# Altium schematic sheet WL-CONTROL.SchDoc
size 420 x 297 mm; Address1: Address1; Address2: Address2; Address3: Address3; Address4: Address4; DocumentNumber: Wolf-Lite; SheetNumber: 9; Scale: 1:1; DocumentType: Схема электрическая принципиальная; FirstReferrence: UA3REO/R7KBI
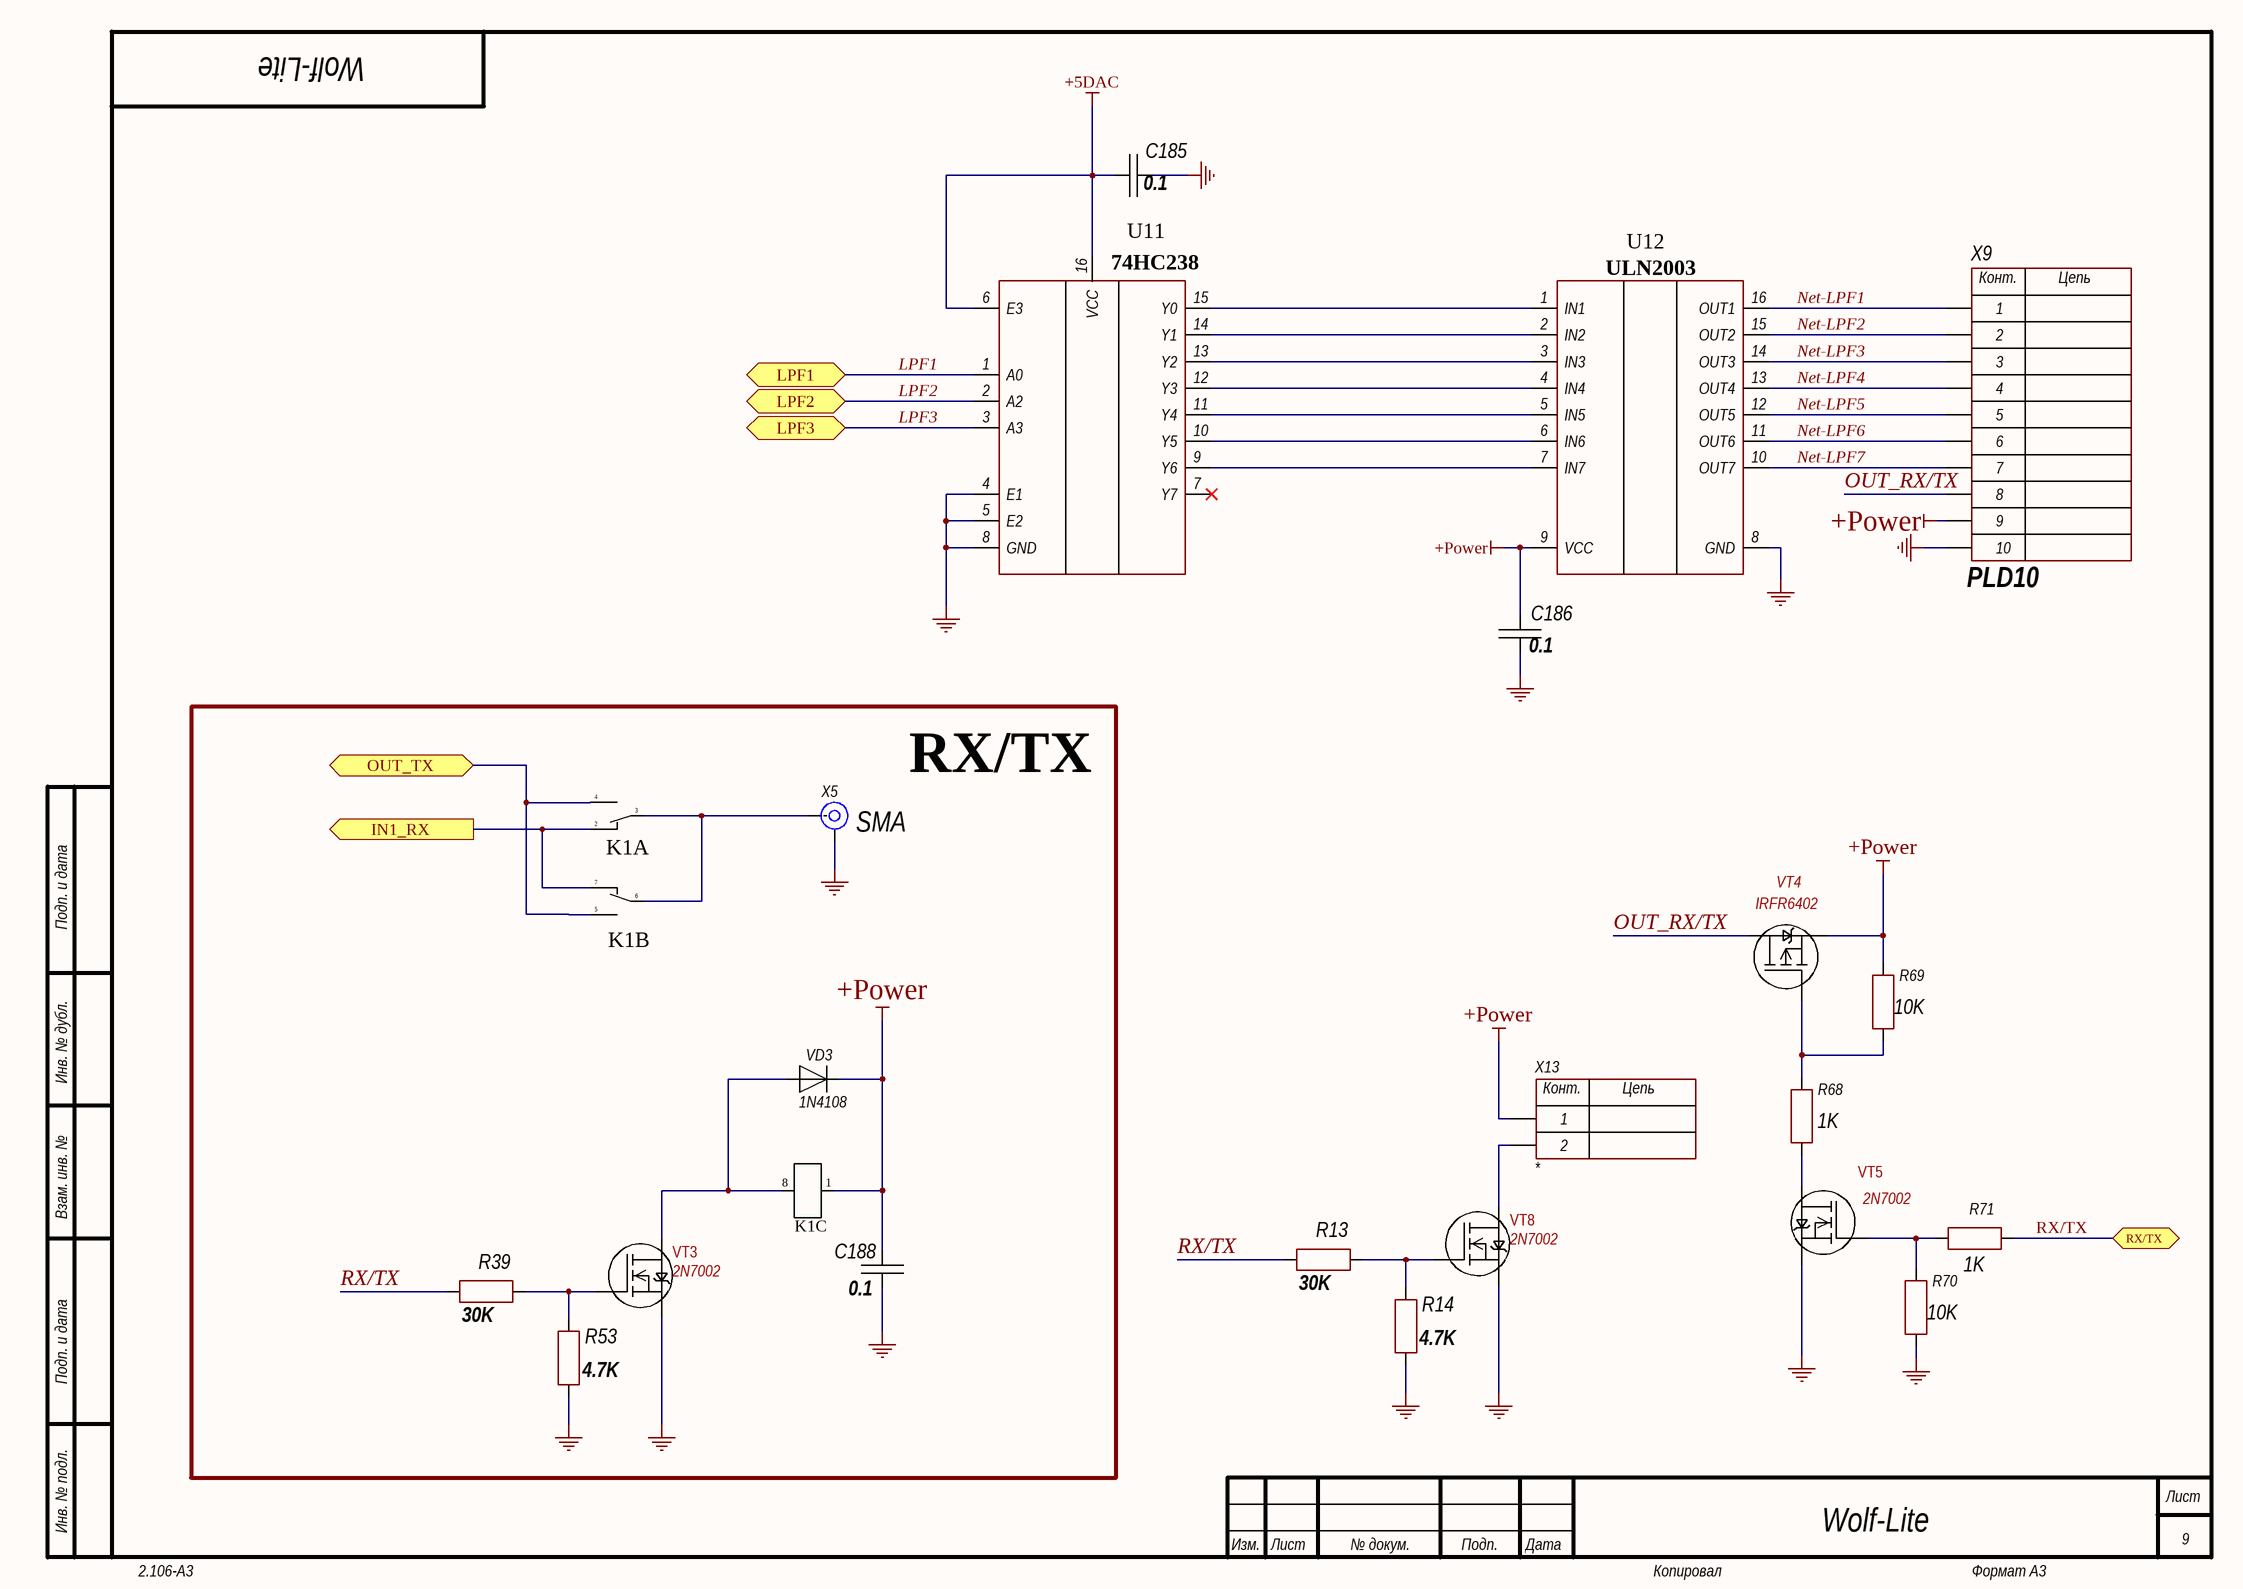
[diagram p0: WL-CONTROL.SchDoc]

## Parts
C185  0.1  [CH0805C]
C186  0.1  [CH0805C]
C188  0.1  [CH0805C]
K1  IM06  [IMG06]  (value not drawn)  (parts A,B,C of 3)
R13  30K  [CH0805R]
R14  4.7K  [CH0805R]
R39  30K  [CH0805R]
R53  4.7K  [CH0805R]
R68  1K  [CH0805R]
R69  10K  [CH0805R]
R70  10K  [CH0805R]
R71  1K  [CH0805R]
U11  74HC238  [16-SOIC]
U12  ULN2003  [16-SOIC]
VD3  1N4108  [1N4148]
VT3  2N7002  [SOT23_132]
VT4  IRFR6402  [SOT23_132]
VT5  2N7002  [SOT23_132]
VT8  2N7002  [SOT23_132]
X5  SMA  [CON: SMA]
X9  PLD10  [CON: PLD-10]
X13  *  [CON: PLS-2]

## Blocks framed on the sheet
RX/TX: C188 K1 R39 R53 VD3 VT3 X5

## Ports
IN1_RX (out), LPF1 (bidir), LPF2 (bidir), LPF3 (bidir), OUT_TX (bidir), RX/TX (bidir)

## Nets
+5DAC: C185.1 U11.6(E3) U11.16(VCC)
+Power: C186.2 C188.1 K1.1 R69.2 U12.9(VCC) VD3.2 VT4.2(I) X9.9 X13.1
GND: C185.2 C186.1 C188.2 R14.1 R53.1 R70.1 U11.4(E1) U11.5(E2) U11.8(GND) U12.8(GND) VT3.2(I) VT5.2(I) VT8.2(I) X5.2(IN) X9.10
IN1_RX: K1.2 K1.7 ; port IN1_RX
LPF1: U11.1(A0) ; port LPF1
LPF2: U11.2(A2) ; port LPF2
LPF3: U11.3(A3) ; port LPF3
Net-LPF1: U12.16(OUT1) X9.1
Net-LPF2: U12.15(OUT2) X9.2
Net-LPF3: U12.14(OUT3) X9.3
Net-LPF4: U12.13(OUT4) X9.4
Net-LPF5: U12.12(OUT5) X9.5
Net-LPF6: U12.11(OUT6) X9.6
Net-LPF7: U12.10(OUT7) X9.7
OUT_RX/TX: VT4.3(Сток(Drain)) X9.8
OUT_TX: K1.4 K1.5 ; port OUT_TX
RX/TX: R13.2 R39.2 R71.1 ; port RX/TX
NetK1_3: K1.3 K1.6 X5.1(IN)
NetK1_8: K1.8 VD3.1 VT3.3(Сток(Drain))
NetR13_1: R13.1 R14.2 VT8.1(Затвор(Gate))
NetR39_1: R39.1 R53.2 VT3.1(Затвор(Gate))
NetR68_1: R68.1 VT5.3(Сток(Drain))
NetR68_2: R68.2 R69.1 VT4.1(Затвор(Gate))
NetR70_2: R70.2 R71.2 VT5.1(Затвор(Gate))
NetU11_9: U11.9(Y6) U12.7(IN7)
NetU11_10: U11.10(Y5) U12.6(IN6)
NetU11_11: U11.11(Y4) U12.5(IN5)
NetU11_12: U11.12(Y3) U12.4(IN4)
NetU11_13: U11.13(Y2) U12.3(IN3)
NetU11_14: U11.14(Y1) U12.2(IN2)
NetU11_15: U11.15(Y0) U12.1(IN1)
NetVT8_3: VT8.3(Сток(Drain)) X13.2

Not connected (* = marked no-connect by the designer): U11 7(Y7)*

## Notes on the sheet
- Подп. и дата
- Инв. № дубл.
- Взам. инв. №
- Инв. № подл.
- Изм.
- Лист
- № докум.
- Подп.
- Дата
- 2.106-A3
- Копировал
- Формат А3
- (in symbol 2-Connector) Конт.; Цепь
- (in symbol 10-Connector) Конт.; Цепь

## Library data of the parts
C185 C186 C188 = Capacitor: Manufacturer: *; Model: *; HelpURL: *; ComponentKind: *; Value: *
K1 = IM06-1
R13 R14 R39 R53 R68-R71 = Resistor: Manufacturer: *; Model: *; HelpURL: *; ComponentKind: *; Value: *
U12 = ULN2003_NEW
VD3 = Diod: ComponentKind: *; Manufacturer: *; Model: *; HelpURL: *
VT3 VT5 VT8 = N-KANAL
VT4 = P-KANAL
X5 = SMA: RF; Model: *; Manufacturer: *; HelpURL: *; ComponentKind: *
X9 = 10-Connector: Model: *; Manufacturer: *; HelpURL: *; ComponentKind: *
X13 = 2-Connector: Model: *; Manufacturer: *; HelpURL: *; ComponentKind: *